# EAGLE schematic SCH BEL RUMAH (EAGLE 9.6.2)
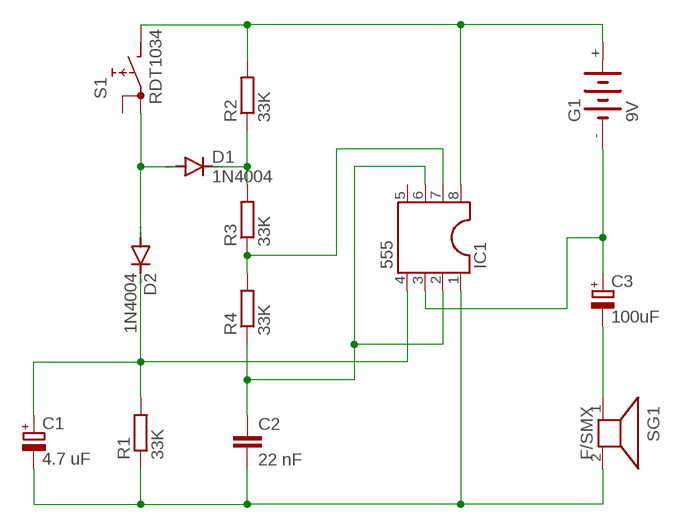
[diagram p0: schematic, sheet 1]

## Parts
C1  4.7 uF  CPOL-EUTT2D5  [TT2D5]
C2  22 nF  C-EU025-024X044  [C025-024X044]
C3  100uF  CPOL-EUTT2D5  [TT2D5]
D1  1N4004  [DO41-10]
D2  1N4004  [DO41-10]
G1  9V  3V11R  [3V11R]
IC1  555  DIL8  [DIL08]
R1  33K  R-EU_0204/7  [0204/7]
R2  33K  R-EU_0204/7  [0204/7]
R3  33K  R-EU_0204/7  [0204/7]
R4  33K  R-EU_0204/7  [0204/7]
S1  RDT1034  [RDT1034]
SG1  F/SMX  [F/SMX]

## Nets
N$1: G1.+ IC1.8 R2.2 S1.B
N$2: D1.A D2.A S1.A1
N$3: D1.C R2.1 R3.2
N$4: IC1.7 R3.1 R4.2
N$5: C1.+ D2.C IC1.4 R1.2
N$6: C1.- C2.2 IC1.1 R1.1 SG1.2
N$7: C2.1 IC1.2 IC1.6 R4.1
N$9: C3.- SG1.1
N$12: C3.+ G1.- IC1.3
Unconnected: IC1.5 S1.A

## Library data of the parts
C1 C3 = rcl:CPOL-EU: POLARIZED CAPACITOR, European symbol; SPICEPREFIX: C
C2 = rcl:C-EU: CAPACITOR, European symbol; SPICEPREFIX: C
D1 D2 = diode:1N4004: DIODE general purpose rectifier, 1 A
G1 = battery:3V11R: NC ACCU Varta
IC1 = ic-package:DIL8: Dual In Line / Socket
R1-R4 = rcl:R-EU_: RESISTOR, European symbol; SPICEPREFIX: R
S1 = switch:RDT1034: PUSH SWITCH www.radiohm.com
SG1 = buzzer:F/SMX: BUZZER Source: Buerklin; OC_FARNELL: unknown; OC_NEWARK: unknown